# Altium schematic sheet Input.SchDoc
size A; SheetNumber: 1; SheetTotal: 6
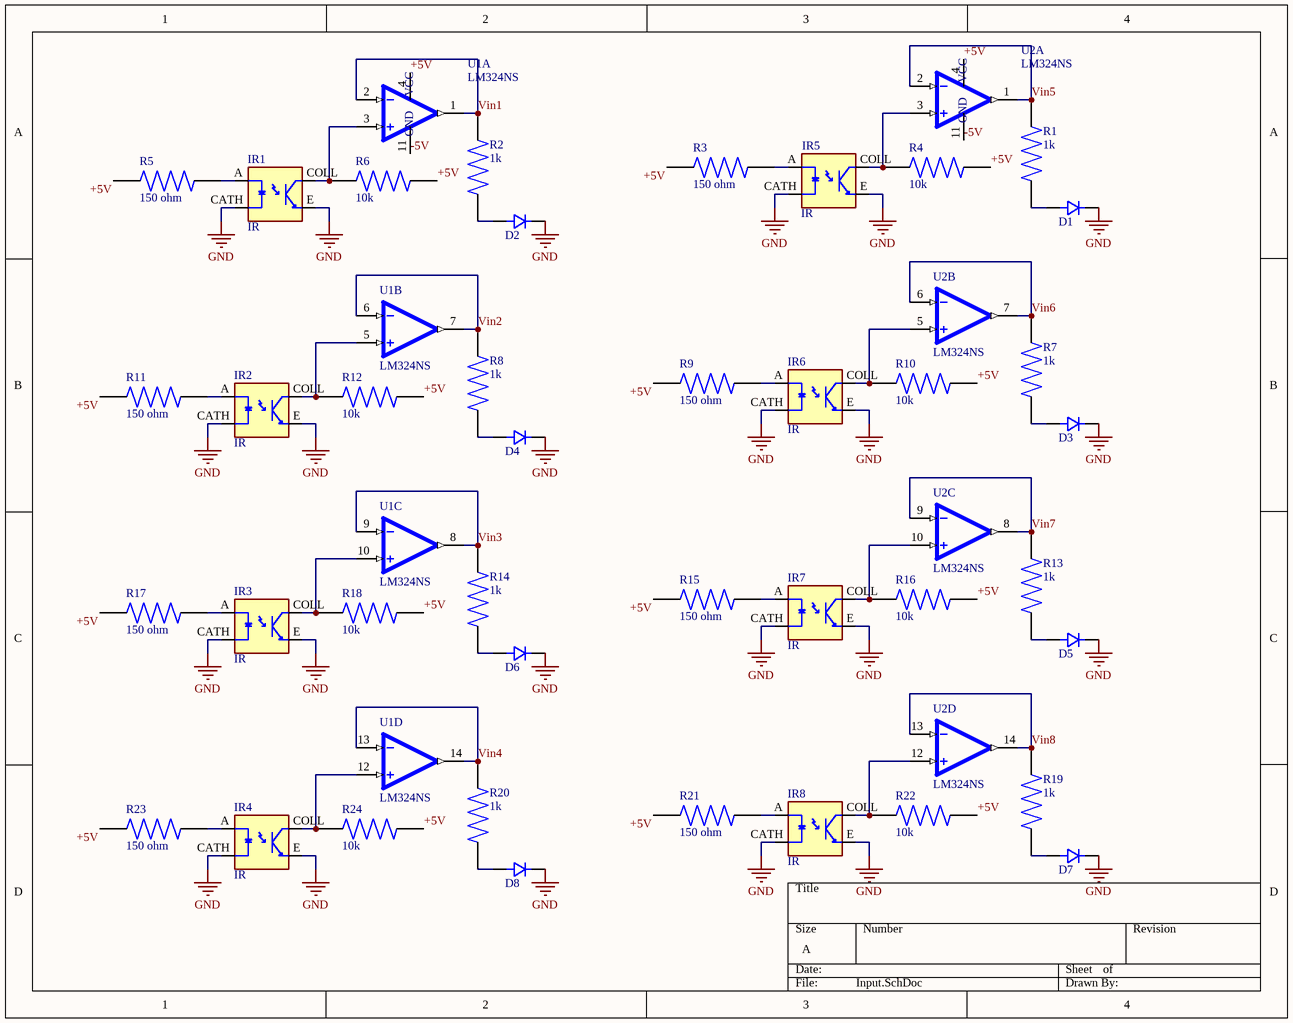
[diagram p0: Input.SchDoc]

## Parts
D1  150080RS75000  [150080RS75000]  (value not drawn)
D2  150080RS75000  [150080RS75000]  (value not drawn)
D3  150080RS75000  [150080RS75000]  (value not drawn)
D4  150080RS75000  [150080RS75000]  (value not drawn)
D5  150080RS75000  [150080RS75000]  (value not drawn)
D6  150080RS75000  [150080RS75000]  (value not drawn)
D7  150080RS75000  [150080RS75000]  (value not drawn)
D8  150080RS75000  [150080RS75000]  (value not drawn)
IR1  IR  [OPTO_TCRT5000]
IR2  IR  [OPTO_TCRT5000]
IR3  IR  [OPTO_TCRT5000]
IR4  IR  [OPTO_TCRT5000]
IR5  IR  [OPTO_TCRT5000]
IR6  IR  [OPTO_TCRT5000]
IR7  IR  [OPTO_TCRT5000]
IR8  IR  [OPTO_TCRT5000]
R1  1k  [RESC2012X60N]
R2  1k  [RESC2012X60N]
R3  150 ohm  [RESC2012X60N]
R4  10k  [RESC2012X60N]
R5  150 ohm  [RESC2012X60N]
R6  10k  [RESC2012X60N]
R7  1k  [RESC2012X60N]
R8  1k  [RESC2012X60N]
R9  150 ohm  [RESC2012X60N]
R10  10k  [RESC2012X60N]
R11  150 ohm  [RESC2012X60N]
R12  10k  [RESC2012X60N]
R13  1k  [RESC2012X60N]
R14  1k  [RESC2012X60N]
R15  150 ohm  [RESC2012X60N]
R16  10k  [RESC2012X60N]
R17  150 ohm  [RESC2012X60N]
R18  10k  [RESC2012X60N]
R19  1k  [RESC2012X60N]
R20  1k  [RESC2012X60N]
R21  150 ohm  [RESC2012X60N]
R22  10k  [RESC2012X60N]
R23  150 ohm  [RESC2012X60N]
R24  10k  [RESC2012X60N]
U1  LM324NS  [SOIC127P780X200-14N]  (parts A,B,C,D of 4)
U2  LM324NS  [SOIC127P780X200-14N]  (parts A,B,C,D of 4)

## Nets
GND: D1.2 D2.2 D3.2 D4.2 D5.2 D6.2 D7.2 D8.2 IR1.CATH IR1.E IR2.CATH IR2.E IR3.CATH IR3.E IR4.CATH IR4.E IR5.CATH IR5.E IR6.CATH IR6.E IR7.CATH IR7.E IR8.CATH IR8.E
+5V: R3.1 R4.2 R5.1 R6.2 R9.1 R10.2 R11.1 R12.2 R15.1 R16.2 R17.1 R18.2 R21.1 R22.2 R23.1 R24.2 U1.4(VCC) U2.4(VCC)
-5V: U1.11(GND) U2.11(GND)
Vin1: R2.2 U1.1(1OUT) U1.2(1IN-)
Vin2: R8.2 U1.6(2IN-) U1.7(2OUT)
Vin3: R14.2 U1.8(3OUT) U1.9(3IN-)
Vin4: R20.2 U1.13(4IN-) U1.14(4OUT)
Vin5: R1.2 U2.1(1OUT) U2.2(1IN-)
Vin6: R7.2 U2.6(2IN-) U2.7(2OUT)
Vin7: R13.2 U2.8(3OUT) U2.9(3IN-)
Vin8: R19.2 U2.13(4IN-) U2.14(4OUT)
NetD1_1: D1.1 R1.1
NetD2_1: D2.1 R2.1
NetD3_1: D3.1 R7.1
NetD4_1: D4.1 R8.1
NetD5_1: D5.1 R13.1
NetD6_1: D6.1 R14.1
NetD7_1: D7.1 R19.1
NetD8_1: D8.1 R20.1
NetIR1_A: IR1.A R5.2
NetIR1_COLL: IR1.COLL R6.1 U1.3(1IN+)
NetIR2_A: IR2.A R11.2
NetIR2_COLL: IR2.COLL R12.1 U1.5(2IN+)
NetIR3_A: IR3.A R17.2
NetIR3_COLL: IR3.COLL R18.1 U1.10(3IN+)
NetIR4_A: IR4.A R23.2
NetIR4_COLL: IR4.COLL R24.1 U1.12(4IN+)
NetIR5_A: IR5.A R3.2
NetIR5_COLL: IR5.COLL R4.1 U2.3(1IN+)
NetIR6_A: IR6.A R9.2
NetIR6_COLL: IR6.COLL R10.1 U2.5(2IN+)
NetIR7_A: IR7.A R15.2
NetIR7_COLL: IR7.COLL R16.1 U2.10(3IN+)
NetIR8_A: IR8.A R21.2
NetIR8_COLL: IR8.COLL R22.1 U2.12(4IN+)

## Library data of the parts
IR1-IR8 = IR: 950 nm 60 mA Through Hole Reflective Optical Sensor with Transistor Output; TCRT5000; Availability: Unavailable; MP: TCRT5000; Value: *; Price: None; Package: None
R1 R2 R7 R8 R13 R14 R19 R20 = 1k: 1 kOhms Â±1% 0.125W, 1/8W Chip Resistor 0805 (2012 Metric) Moisture Resistant Thick Film; RC0805FR-071KL; MF: Yageo; DigiKey_Part_Number: 311-1.00KCRTR-ND; Purchase-URL: https://pricing.snapeda.com/search?q=RC0805FR-071KL&ref=eda; Package: 2012 Yageo; Check_prices: https://www.snapeda.com/parts/RC0805FR-071KL/Yageo/view-part/?ref=eda; Value: *; SnapEDA_Link: https://www.snapeda.com/parts/RC0805FR-071KL/Yageo/view-part/?ref=snap; MP: RC0805FR-071KL
R3 R5 R9 R11 R15 R17 R21 R23 = 150 ohm: 150 Ohms Â±1% 0.125W, 1/8W Chip Resistor 0805 (2012 Metric) Moisture Resistant Thick Film; RC0805FR-07150RL; MF: Yageo; SnapEDA_Link: https://www.snapeda.com/parts/RC0805FR-07150RL/Yageo/view-part/?ref=snap; Package: 2012 Yageo; Value: *; MP: RC0805FR-07150RL; Check_prices: https://www.snapeda.com/parts/RC0805FR-07150RL/Yageo/view-part/?ref=eda
R4 R6 R10 R12 R16 R18 R22 R24 = 10k: 10 kOhms Â±1% 0.125W, 1/8W Chip Resistor 0805 (2012 Metric) Moisture Resistant Thick Film; RC0805FR-0710KL; MF: Yageo; Value: *; SnapEDA_Link: https://www.snapeda.com/parts/RC0805FR-0710KL/Yageo/view-part/?ref=snap; Purchase-URL: https://pricing.snapeda.com/search/part/RC0805FR-0710KL/?ref=eda; Availability: In Stock; Price: None; Package: 2012 Rohm Semiconductor; Check_prices: https://www.snapeda.com/parts/RC0805FR-0710KL/Yageo/view-part/?ref=eda; MP: RC0805FR-0710KL
U1 U2 = LM324NS: 4-Channel industry standard operational amplifier 14-SO 0 to 70; LM324NSRG4; MF: Texas Instruments; Purchase-URL: https://pricing.snapeda.com/search/part/LM324NSRG4/?ref=eda; MP: LM324NSRG4; SnapEDA_Link: https://www.snapeda.com/parts/LM324NSRG4/Texas+Instruments/view-part/?ref=snap; Value: *; Package: SOP-14 Texas Instruments; Price: None; Availability: In Stock; Check_prices: https://www.snapeda.com/parts/LM324NSRG4/Texas+Instruments/view-part/?ref=eda